# EAGLE schematic MI0283QT_v12b (EAGLE 6.6.0)
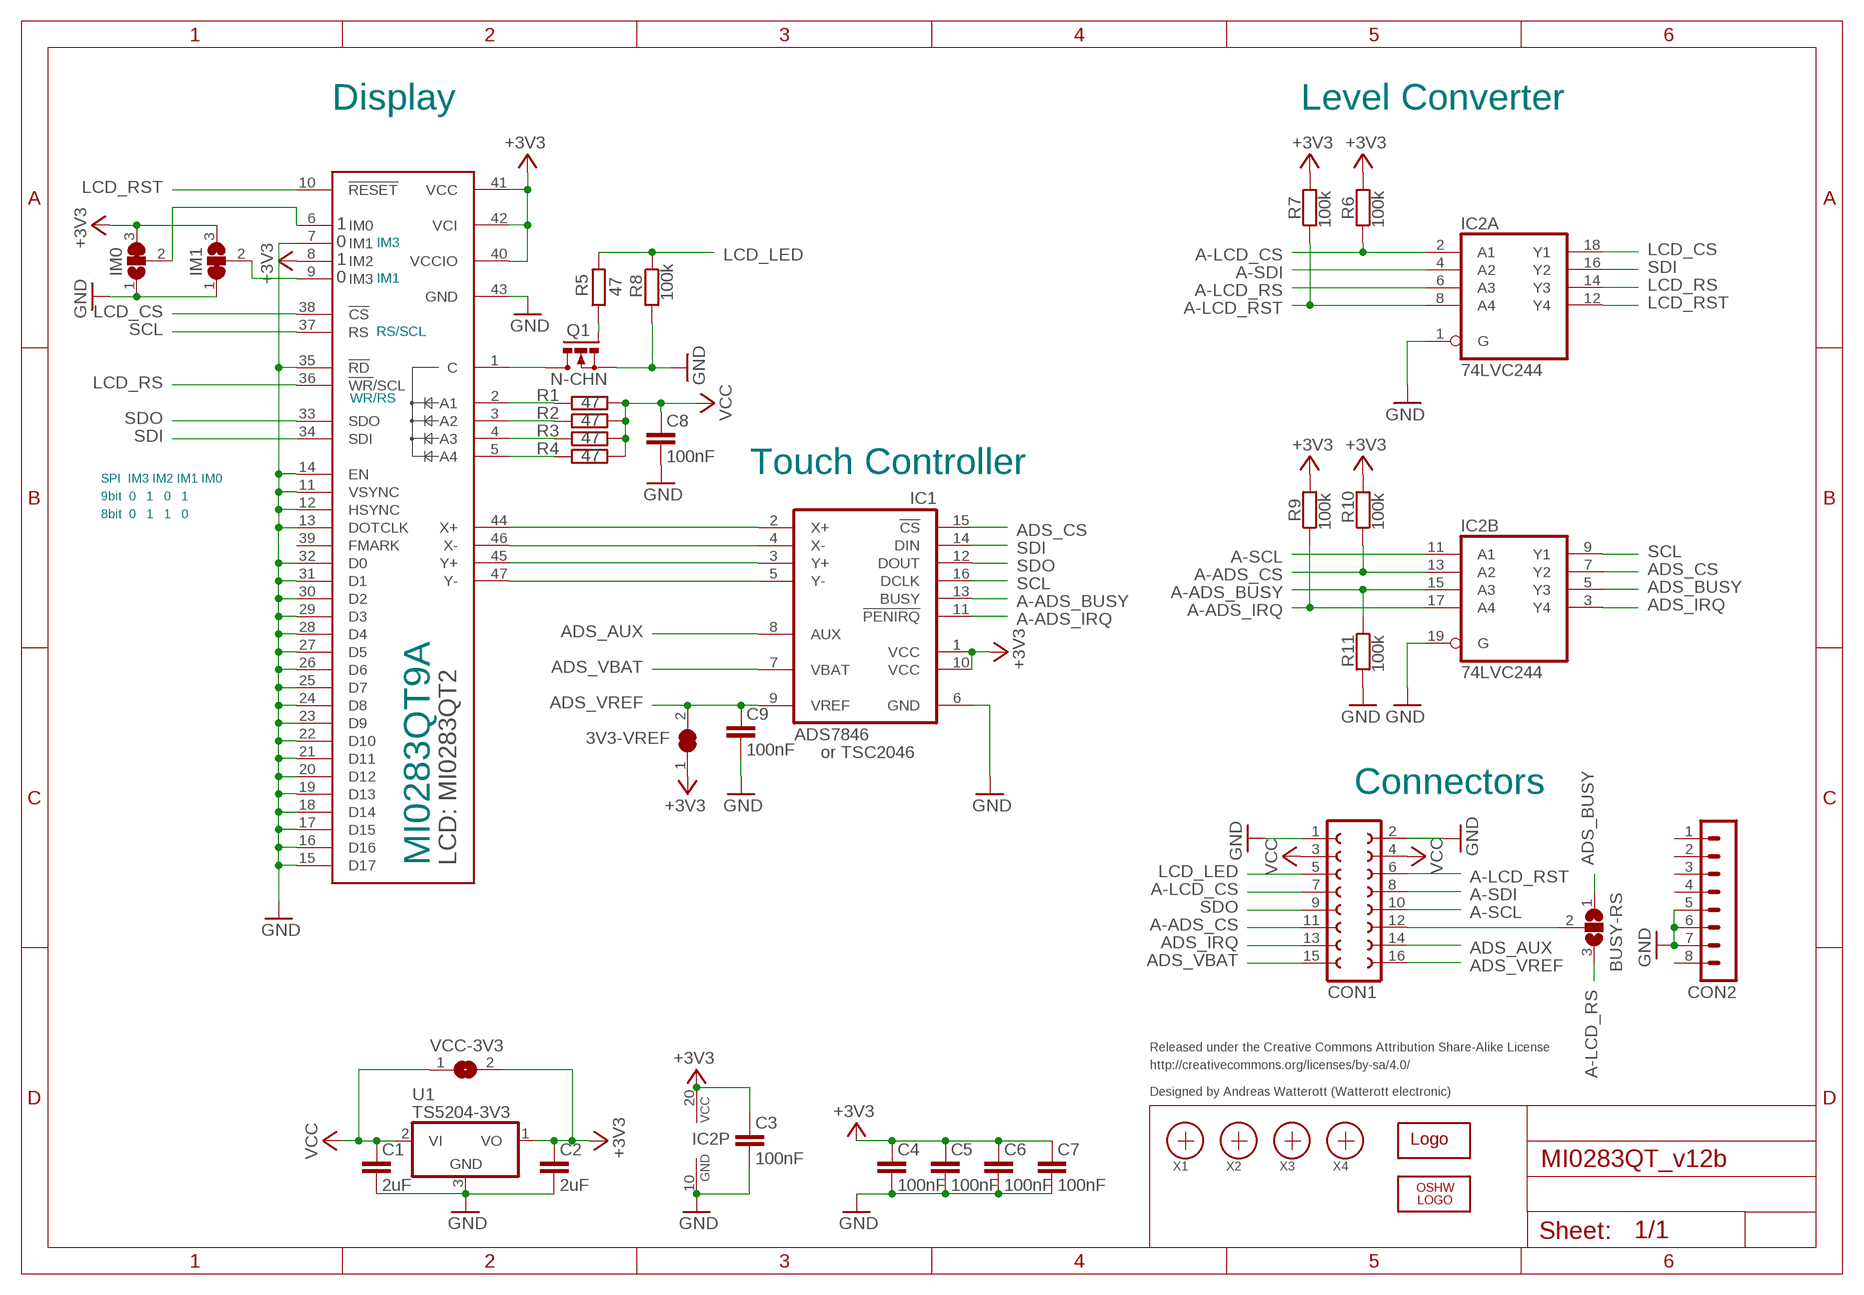
[diagram p0: schematic, sheet 1]

## Parts
3V3-VREF  SJ  [SJ]
BUSY-RS  SJ2W  [SJ_2]
C1  2uF  C-EUC0805  [C0805]
C2  2uF  C-EUC0805  [C0805]
C3  100nF  C-EUC0603  [C0603]
C4  100nF  C-EUC0603  [C0603]
C5  100nF  C-EUC0603  [C0603]
C6  100nF  C-EUC0603  [C0603]
C7  100nF  C-EUC0603  [C0603]
C8  100nF  C-EUC0603  [C0603]
C9  100nF  C-EUC0603  [C0603]
CON1  FE08-2  [FE08-2]
CON2  MA08-1  [MA08-1]
IC1  ADS7846  [SSOP16]
IC2  74LVC244  74HC244DW  [SO20W]
IM0  SJ2W  [SJ_2]
IM1  SJ2W  [SJ_2]
LCD  MI0283QT  [MI0283QT]
LOGO1  OSHW_LOGO_6MILX0150-NT  [OSHW_6X150_NOTEXT]
Q1  N-CHN  IRLML2502  [MICRO3]
R1  47  R-EU_R0603  [R0603]
R2  47  R-EU_R0603  [R0603]
R3  47  R-EU_R0603  [R0603]
R4  47  R-EU_R0603  [R0603]
R5  47  R-EU_R0603  [R0603]
R6  100k  R-EU_R0603  [R0603]
R7  100k  R-EU_R0603  [R0603]
R8  100k  R-EU_R0603  [R0603]
R9  100k  R-EU_R0603  [R0603]
R10  100k  R-EU_R0603  [R0603]
R11  100k  R-EU_R0603  [R0603]
U1  TS5204-3V3  TS5204  [SOT23]
U$1  WE-LOGO  [WE-LOGO]
VCC-3V3  SJ  [SJ]
X1  PASSER  [PASSER]
X2  PASSER  [PASSER]
X3  PASSER  [PASSER]
X4  PASSER  [PASSER]

## Nets
+3V3: 3V3-VREF.1 C2.1 C3.1 C4.1 C5.1 C6.1 C7.1 IC1.1(VCC) IC1.10(VCC) IC2.20(P:VCC) IM0.3 IM1.3 LCD.8(IM2) LCD.40(VCCIO) LCD.41(VCC) LCD.42(VCI) R6.2 R7.2 R9.2 R10.2 U1.1(VO) VCC-3V3.2
A-ADS_BUSY: IC1.13(BUSY) IC2.15(B:A3) R11.1
A-ADS_CS: CON1.11 IC2.13(B:A2) R10.1
A-ADS_IRQ: IC1.11(!PENIRQ) IC2.17(B:A4) R9.1
A-LCD_CS: CON1.7 IC2.2(A:A1) R6.1
A-LCD_RS: BUSY-RS.3 IC2.6(A:A3)
A-LCD_RST: CON1.6 IC2.8(A:A4) R7.1
A-SCL: CON1.10 IC2.11(B:A1)
A-SDI: CON1.8 IC2.4(A:A2)
ADS_AUX: CON1.14 IC1.8(AUX)
ADS_BUSY: BUSY-RS.1 IC2.5(B:Y3)
ADS_CS: IC1.15(!CS) IC2.7(B:Y2)
ADS_IRQ: CON1.13 IC2.3(B:Y4)
ADS_VBAT: CON1.15 IC1.7(VBAT)
ADS_VREF: 3V3-VREF.2 C9.1 CON1.16 IC1.9(VREF)
C: LCD.1(C) Q1.3(D)
GND: C1.2 C2.2 C3.2 C4.2 C5.2 C6.2 C7.2 C8.2 C9.2 CON1.1 CON1.2 CON2.5 CON2.6 CON2.7 IC1.6(GND) IC2.1(A:G) IC2.10(P:GND) IC2.19(B:G) IM0.1 IM1.1 LCD.7(IM1) LCD.11(VSYNC) LCD.12(HSYNC) LCD.13(DOTCLK) LCD.14(EN) LCD.15(D17) LCD.16(D16) LCD.17(D15) LCD.18(D14) LCD.19(D13) LCD.20(D12) LCD.21(D11) LCD.22(D10) LCD.23(D9) LCD.24(D8) LCD.25(D7) LCD.26(D6) LCD.27(D5) LCD.28(D4) LCD.29(D3) LCD.30(D2) LCD.31(D1) LCD.32(D0) LCD.35(!RD) LCD.43(GND) Q1.2(S) R8.2 R11.2 U1.3(GND)
IM0: IM0.2 LCD.6(IM0)
LCD_CS: IC2.18(A:Y1) LCD.38(!CS)
LCD_LED: CON1.5 R5.2 R8.1
LCD_RS: IC2.14(A:Y3) LCD.36(!WR!/SCL)
LCD_RST: IC2.12(A:Y4) LCD.10(!RESET)
LED_A1: LCD.2(A1) R1.1
LED_A2: LCD.3(A2) R2.1
LED_A3: LCD.4(A3) R3.1
LED_A4: LCD.5(A4) R4.1
LEDPWM: Q1.1(G) R5.1
N$2: BUSY-RS.2 CON1.12
N$4: IM1.2 LCD.9(IM3)
SCL: IC1.16(DCLK) IC2.9(B:Y1) LCD.37(RS)
SDI: IC1.14(DIN) IC2.16(A:Y2) LCD.34(SDI)
SDO: CON1.9 IC1.12(DOUT) LCD.33(SDO)
VCC: C1.1 C8.1 CON1.3 CON1.4 R1.2 R2.2 R3.2 R4.2 U1.2(VI) VCC-3V3.1
X+: IC1.2(X+) LCD.44(X+)
X-: IC1.4(X-) LCD.46(X-)
Y+: IC1.3(Y+) LCD.45(Y+)
Y-: IC1.5(Y-) LCD.47(Y-)
Unconnected: CON2.1 CON2.2 CON2.3 CON2.4 CON2.8 LCD.39(FMARK)

## Notes on the sheet
- Display | Level Converter
- 1
- 0 | IM3
- 1
- 0 | IM1
- RS/SCL
- WR/RS
- Touch Controller
- SPI  IM3 IM2 IM1 IM0
- 9bit  0   1   0   1
- 8bit  0   1   1   0
- or TSC2046
- Connectors
- MI0283QT9A
- Released under the Creative Commons Attribution Share-Alike License
- http://creativecommons.org/licenses/by-sa/4.0/
- Designed by Andreas Watterott (Watterott electronic)

## Library data of the parts
3V3-VREF VCC-3V3 = jumper:SJ: SMD solder JUMPER
BUSY-RS IM0 IM1 = jumper:SJ2W: SMD solder JUMPER
C1-C9 = rcl:C-EU: CAPACITOR, European symbol
CON1 = con-lsta:FE08-2: FEMALE HEADER
CON2 = con-lstb:MA08-1: PIN HEADER; OC_FARNELL: unknown; OC_NEWARK: unknown
IC1 = Display:ADS7846: ADS7846 Touch Screen Controller
IC2 = 74xx-eu:74*244: Octal BUFFER and LINE DRIVER, 3-state
LCD = Display:MI0283QT: Multi-Inno MIO283QT2 LCD (240x320) with Renesas R61505U controller
LOGO1 = OSHW:OSHW_LOGO_6MIL
Q1 = IRF-sot23:IRLML2502: N-Channel Power MOSFET
R1-R11 = rcl:R-EU_: RESISTOR, European symbol
U1 = Voltage-Reg:TS5204
U$1 = welectronic:WE-LOGO
X1-X4 = SMD:PASSER